# EasyEDA schematic SCH_555振荡器_2022-11-10.json
TITLE: Sheet_1; REV: 1.0; Date: 2022-10-09; Sheet: 1/1; Drawn By: sszb; Company: Your Company
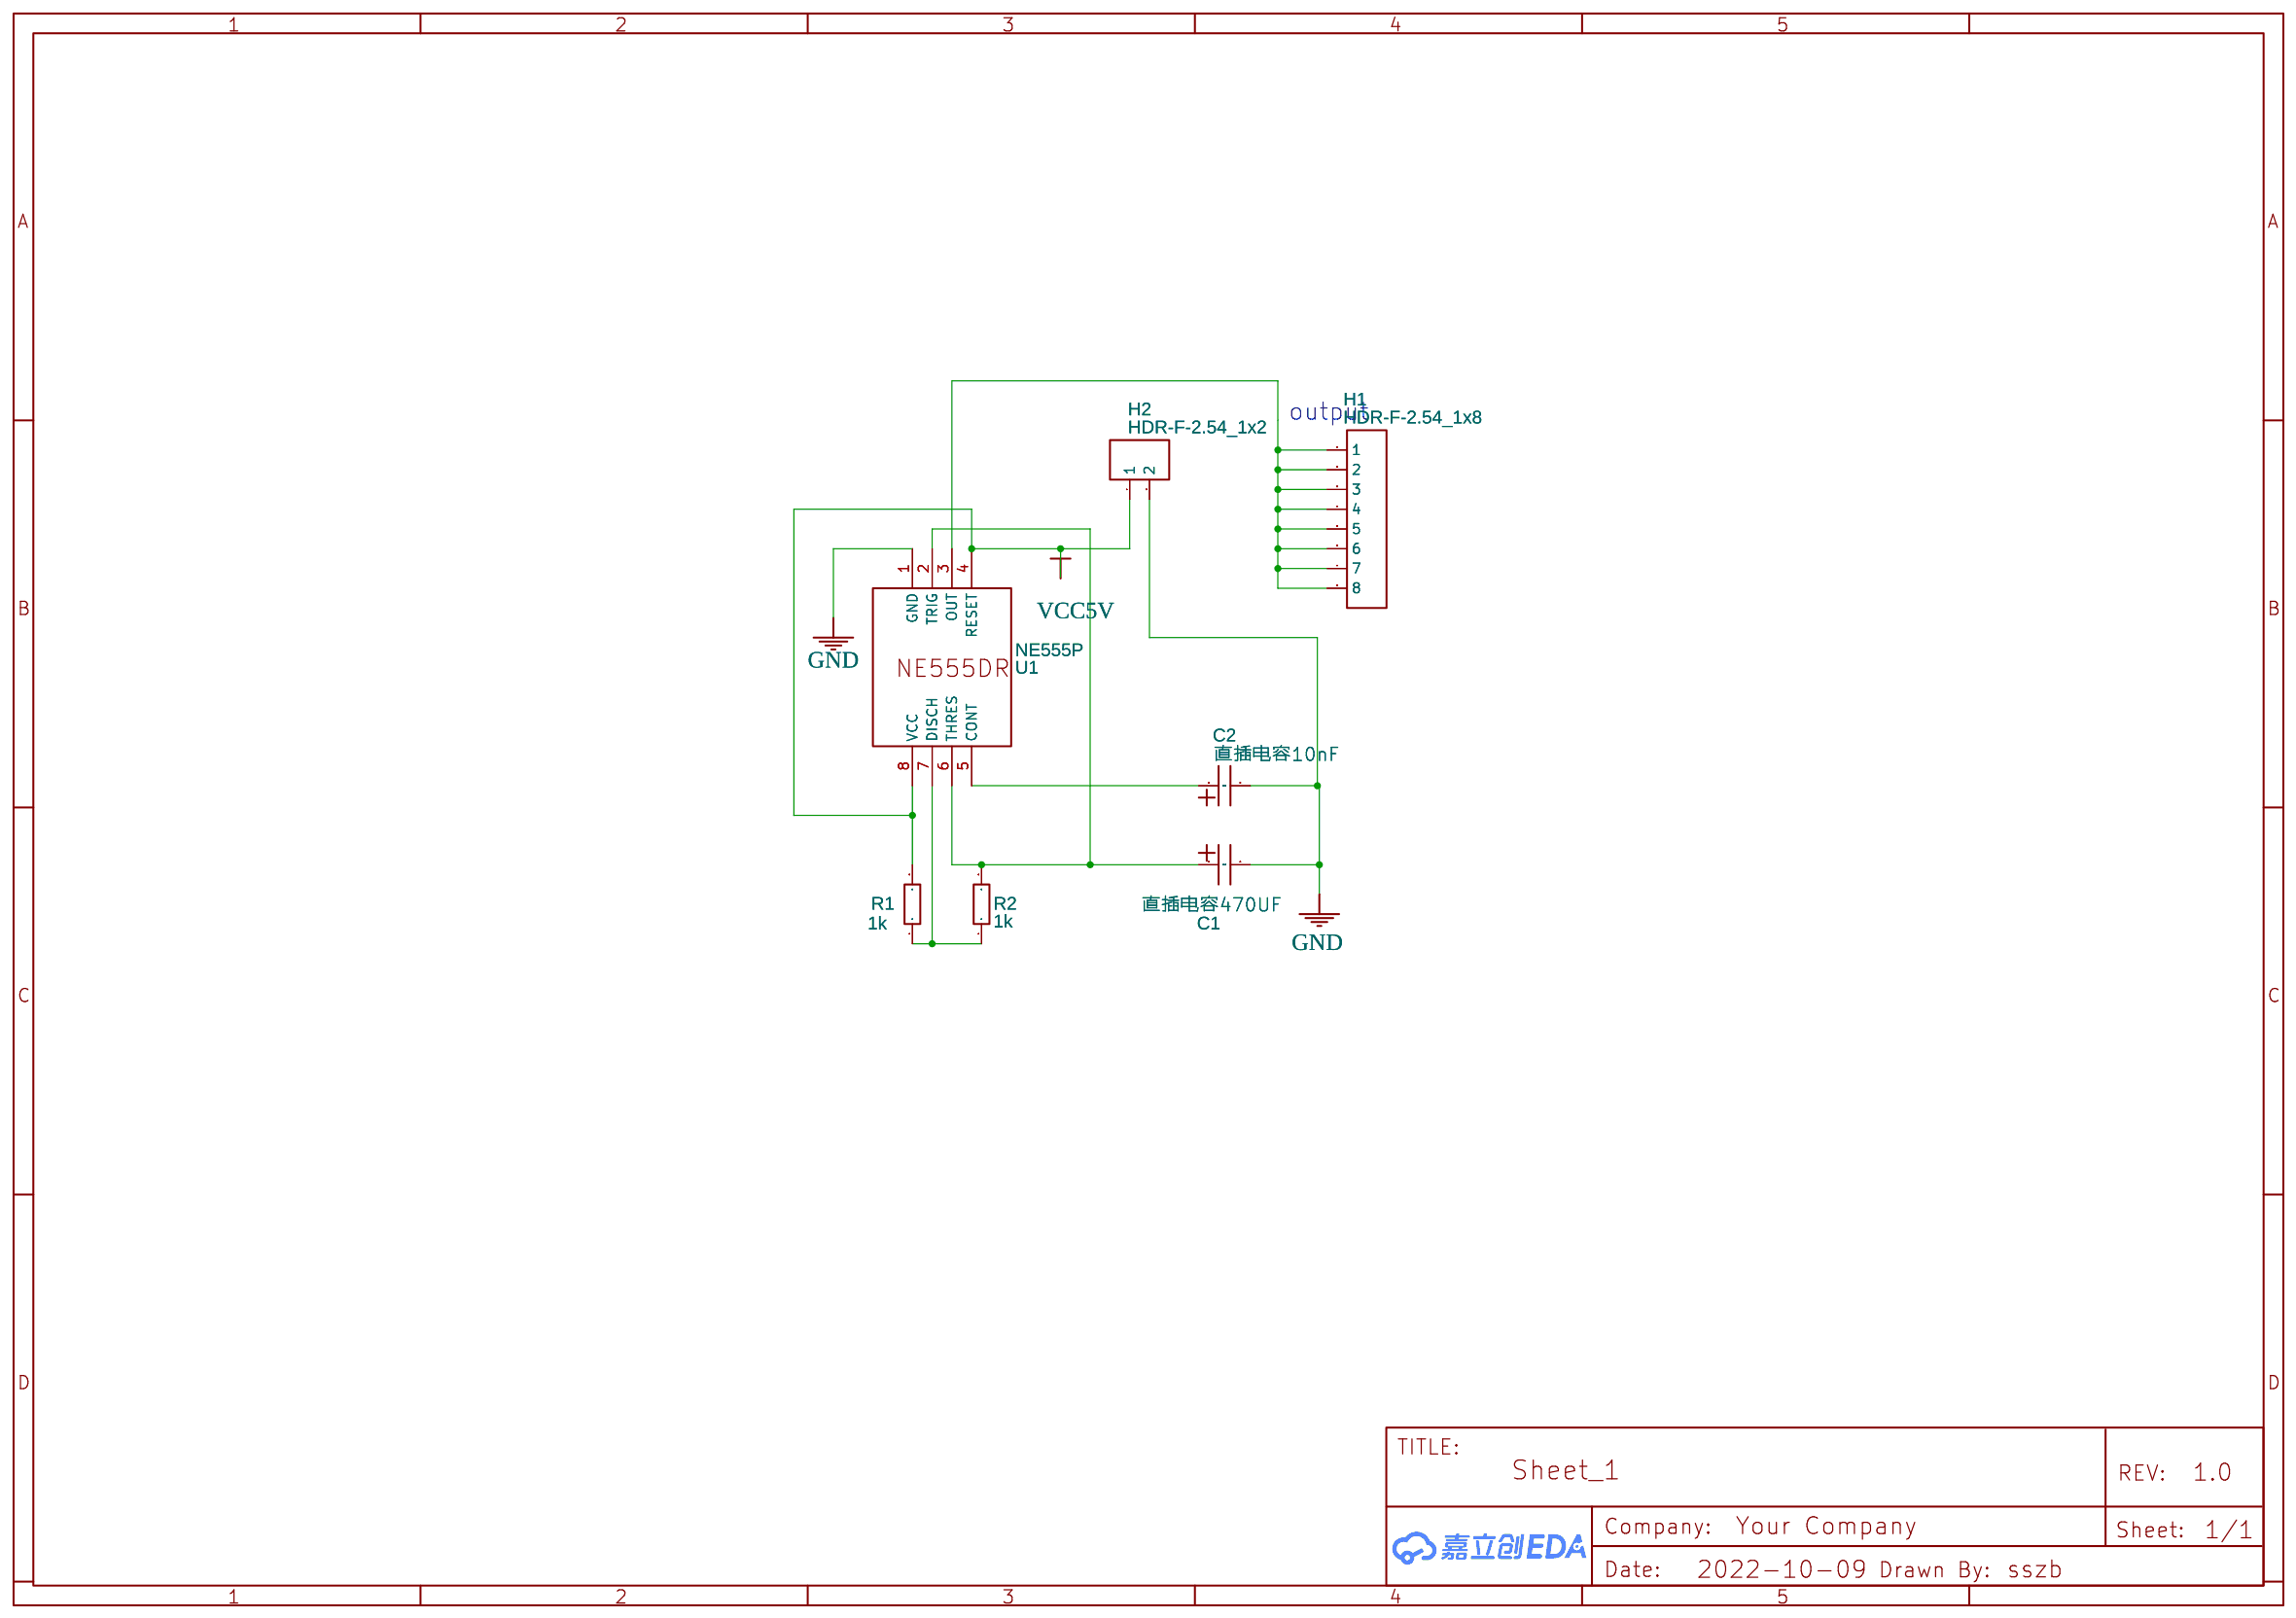
[diagram p0: schematic sheet]

## Parts
C1  直插电容470UF  [直插电容470UF]
C2  直插电容10nF  [直插电容470UF]
H1  HDR-F-2.54_1x8  [HDR-F-2.54_1X8]
H2  HDR-F-2.54_1x2  [HDR-F-2.54_1X2]
R1  1k  [直插电阻]
R2  1k  [直插电阻]
U1  NE555P  [NE555定时器]

## Library data of the parts
C1 C2 = 直插电容470UF: Contributor: 2021X
H1 = HDR-F-2.54_1x8: Supplier Part: C225505; Supplier: LCSC; Contributor: LCEDA_Lib
H2 = HDR-F-2.54_1x2: Supplier Part: C49661; Supplier: LCSC; Contributor: LCEDA_Lib
R1 R2 = 直插电阻: Supplier: LCSC; Manufacturer: UniOhm; Manufacturer Part: CFR0W4J0681A50; Supplier Part: C70784; Contributor: cy1811511104
U1 = NE555P: Contributor: lzhlzh0805

## Nets
GND: C1.2 C2.2 H2.2 U1.1(GND)
VCC5V: H2.1 R1.2 U1.4(RESET) U1.8(VCC)
Net-(C1-1): C1.1 R2.2 U1.2(TRIG) U1.6(THRES)
Net-(C2-1): C2.1 U1.5(CONT)
Net-(H1-1): H1.1 H1.2 H1.3 H1.4 H1.5 H1.6 H1.7 H1.8 U1.3(OUT)
Net-(R1-1): R1.1 R2.1 U1.7(DISCH)

## Notes on the sheet
- output
